# Altium schematic sheet MCU.SchDoc
size A3; SheetNumber: 3; SheetTotal: 7
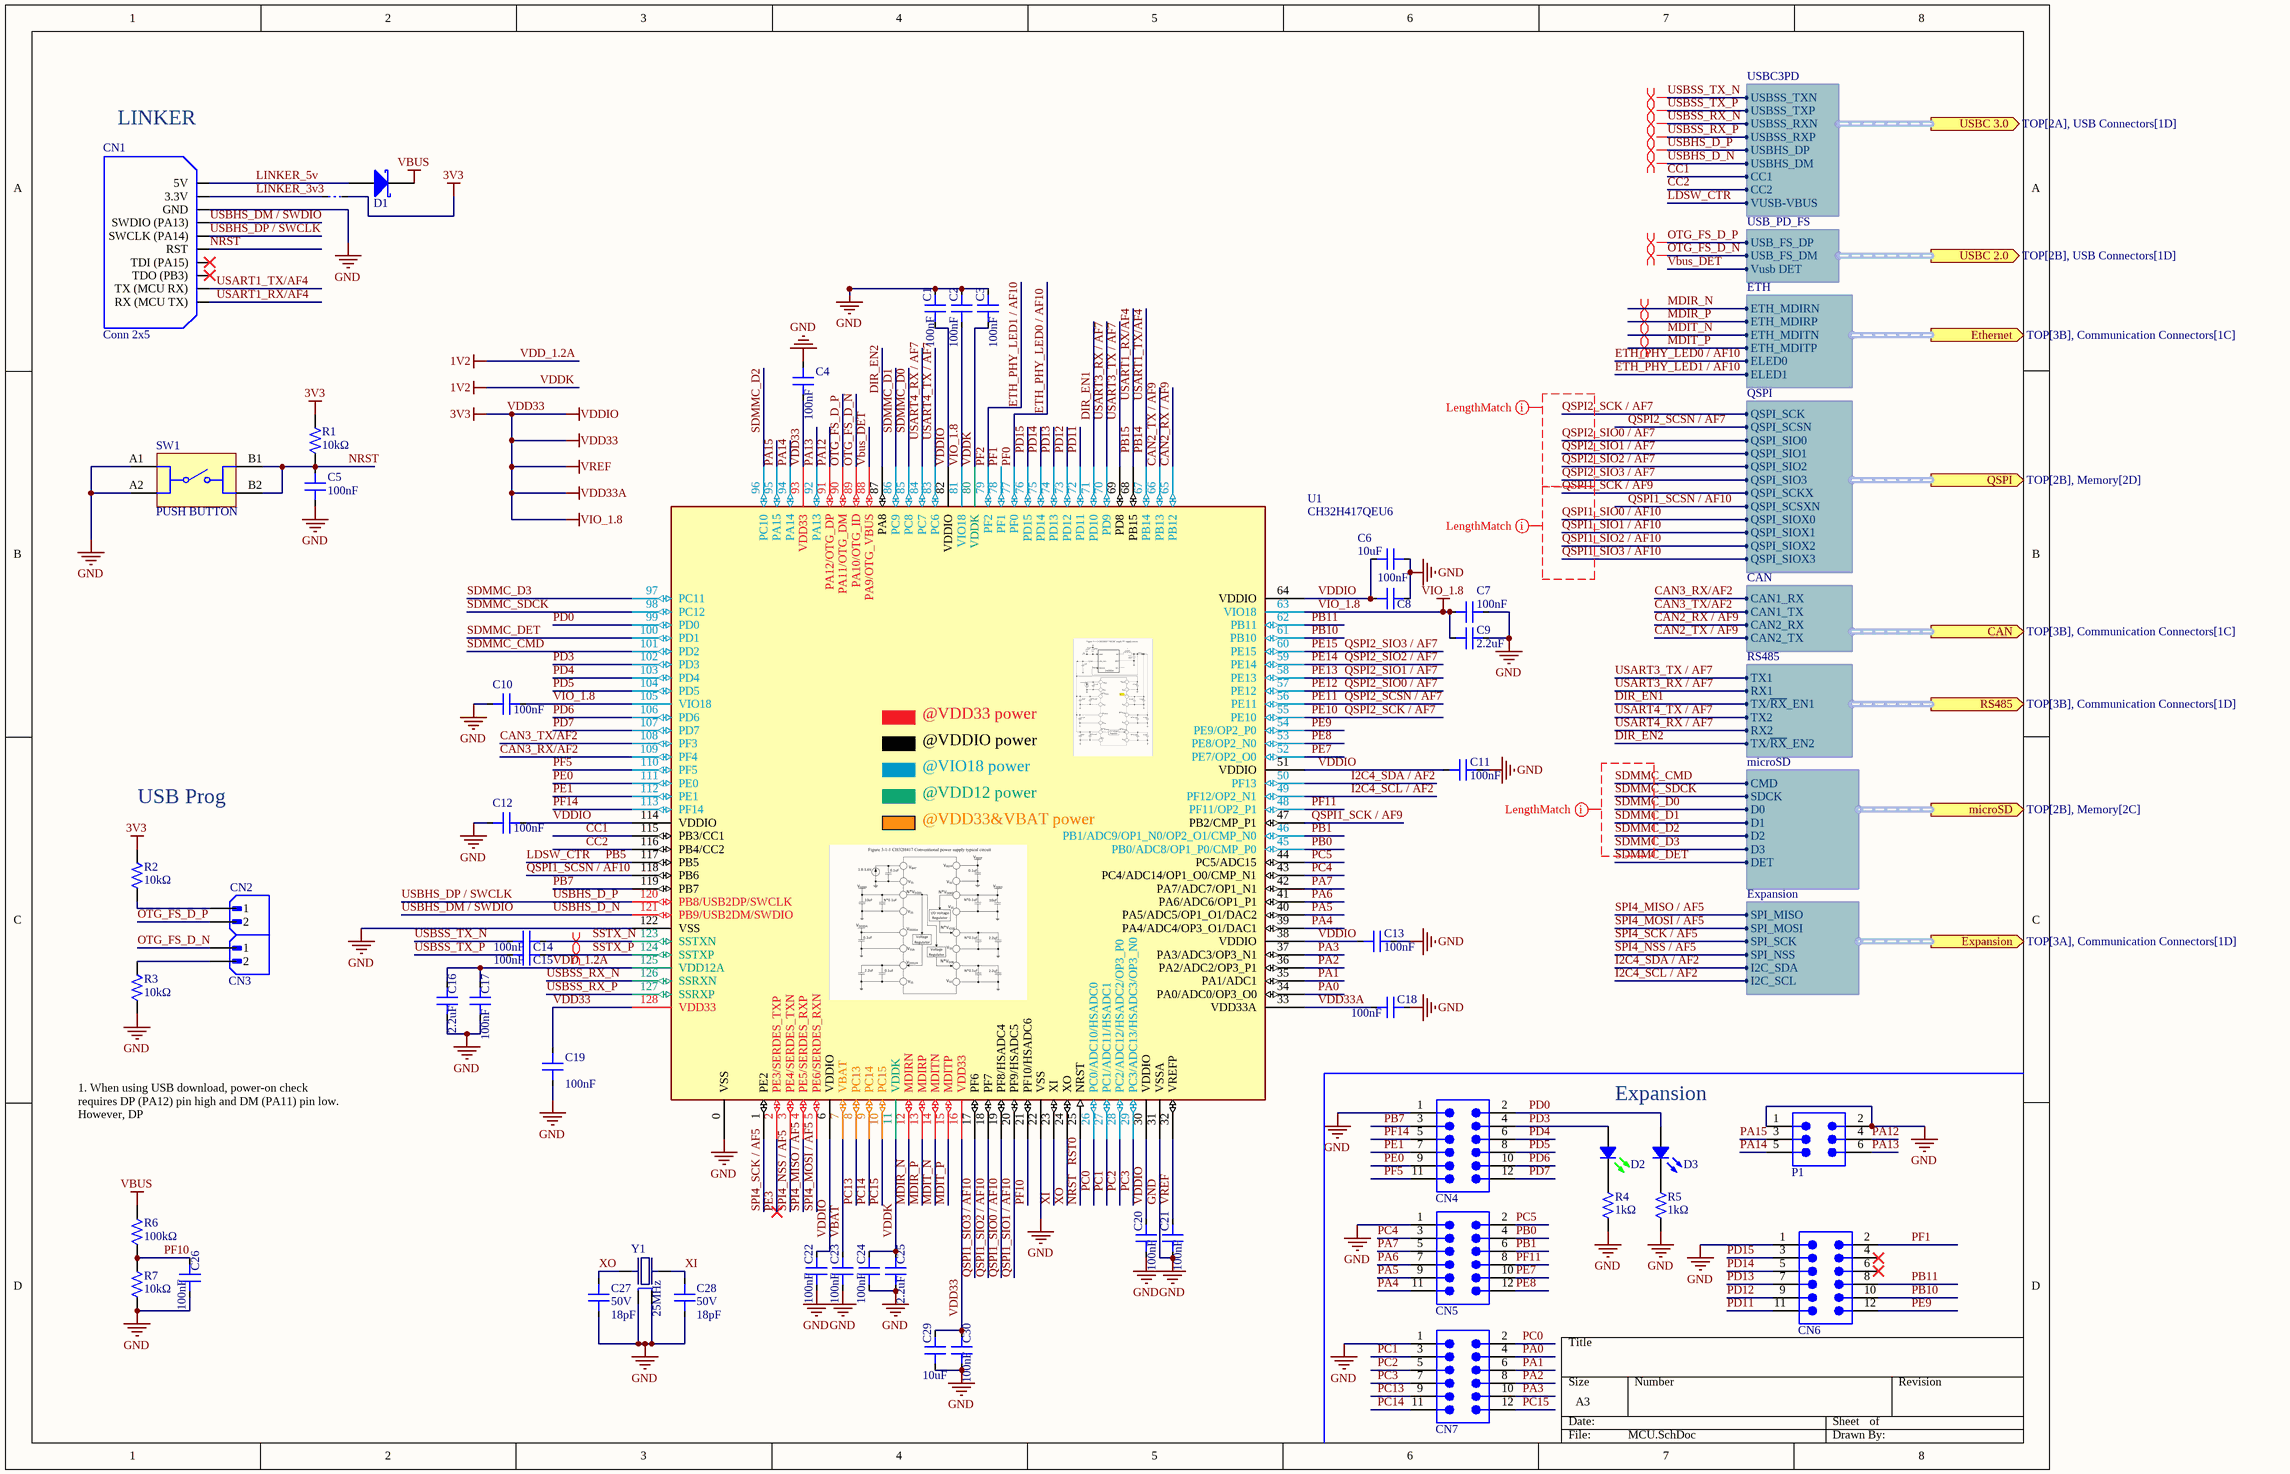
[diagram p0: MCU.SchDoc]

## Parts
C1  Capacitance: 100nF  [C_0603]  (hidden comment: CAP CER 100nF 50V X7R 0603)
C2  Capacitance: 100nF  [C_0603]  (hidden comment: CAP CER 100nF 50V X7R 0603)
C3  Capacitance: 100nF  [C_0603]  (hidden comment: CAP CER 100nF 50V X7R 0603)
C4  Capacitance: 100nF  [C_0603]  (hidden comment: CAP CER 100nF 50V X7R 0603)
C5  Capacitance: 100nF  [C_0603]  (hidden comment: CAP CER 100nF 50V X7R 0603)
C6  Capacitance: 10uF  [C_0805]  (hidden comment: CAP CER 10uF 16V X7R 0805)
C7  Capacitance: 100nF  [C_0603]  (hidden comment: CAP CER 100nF 50V X7R 0603)
C8  Capacitance: 100nF  [C_0603]  (hidden comment: CAP CER 100nF 50V X7R 0603)
C9  Capacitance: 2.2uF  [C_0603]  (hidden comment: CAP CER 2.2uF 16V X5R 0603)
C10  Capacitance: 100nF  [C_0603]  (hidden comment: CAP CER 100nF 50V X7R 0603)
C11  Capacitance: 100nF  [C_0603]  (hidden comment: CAP CER 100nF 50V X7R 0603)
C12  Capacitance: 100nF  [C_0603]  (hidden comment: CAP CER 100nF 50V X7R 0603)
C13  Capacitance: 100nF  [C_0603]  (hidden comment: CAP CER 100nF 50V X7R 0603)
C14  Capacitance: 100nF  [C_0603]  (hidden comment: CAP CER 100nF 50V X7R 0603)
C15  Capacitance: 100nF  [C_0603]  (hidden comment: CAP CER 100nF 50V X7R 0603)
C16  Capacitance: 2.2uF  [C_0603]  (hidden comment: CAP CER 2.2uF 16V X5R 0603)
C17  Capacitance: 100nF  [C_0603]  (hidden comment: CAP CER 100nF 50V X7R 0603)
C18  Capacitance: 100nF  [C_0603]  (hidden comment: CAP CER 100nF 50V X7R 0603)
C19  Capacitance: 100nF  [C_0603]  (hidden comment: CAP CER 100nF 50V X7R 0603)
C20  Capacitance: 100nF  [C_0603]  (hidden comment: CAP CER 100nF 50V X7R 0603)
C21  Capacitance: 100nF  [C_0603]  (hidden comment: CAP CER 100nF 50V X7R 0603)
C22  Capacitance: 100nF  [C_0603]  (hidden comment: CAP CER 100nF 50V X7R 0603)
C23  Capacitance: 100nF  [C_0603]  (hidden comment: CAP CER 100nF 50V X7R 0603)
C24  Capacitance: 100nF  [C_0603]  (hidden comment: CAP CER 100nF 50V X7R 0603)
C25  Capacitance: 2.2uF  [C_0603]  (hidden comment: CAP CER 2.2uF 16V X5R 0603)
C26  Capacitance: 100nF  [C_0603]  (hidden comment: CAP CER 100nF 50V X7R 0603)
C27  Voltage Rating: 50V  Capacitance: 18pF  [C_0603]  (hidden comment: CAP CER 18pF 50V C0G 0603)
C28  Voltage Rating: 50V  Capacitance: 18pF  [C_0603]  (hidden comment: CAP CER 18pF 50V C0G 0603)
C29  Capacitance: 10uF  [C_0805]  (hidden comment: CAP CER 10uF 16V X7R 0805)
C30  Capacitance: 100nF  [C_0603]  (hidden comment: CAP CER 100nF 50V X7R 0603)
CN1  Conn 2x5  [IDC_2x5P_2.54MM_TH]
CN2  CONN HEADER 2POS 2.54mm SINGLE ROW TH  [HEADER_M_2P_2.54MM_TH]  (value not drawn)
CN3  CONN HEADER 2POS 2.54mm SINGLE ROW TH  [HEADER_M_2P_2.54MM_TH]  (value not drawn)
CN4  CONN HEADER 12POS 2.54mm DUAL ROW TH  [HEADER_M_2x6P_2.54MM_TH]  (value not drawn)
CN5  CONN HEADER 12POS 2.54mm DUAL ROW TH  [HEADER_M_2x6P_2.54MM_TH]  (value not drawn)
CN6  CONN HEADER 12POS 2.54mm DUAL ROW TH  [HEADER_M_2x6P_2.54MM_TH]  (value not drawn)
CN7  CONN HEADER 12POS 2.54mm DUAL ROW TH  [HEADER_M_2x6P_2.54MM_TH]  (value not drawn)
D1  DIODE SCHOTTKY 40V SOD-323  [SOD323]  (value not drawn)
D2  LED EMERALD GREEN WATER CLEAR 0603 SMD  [LED_0603]  (value not drawn)
D3  LED BLUE WATER CLEAR 0603 SMD  [LED_0603]  (value not drawn)
J1  JUMPER SMD  [JUMPER SMD 3X1.5 mm]  (value not drawn)  (no BOM)
P1  CONN SOCKET 6POS 2.54mm DUAL ROW TH  [HEADER_F_2x3P_2.54MM_TH]  (value not drawn)
R1  Resistance: 10kΩ  [R_0603]  (hidden comment: RES 10kΩ ±1% 100mW 0603)
R2  Resistance: 10kΩ  [R_0603]  (hidden comment: RES 10kΩ ±1% 100mW 0603)
R3  Resistance: 10kΩ  [R_0603]  (hidden comment: RES 10kΩ ±1% 100mW 0603)
R4  Resistance: 1kΩ  [R_0603]  (hidden comment: RES 1kΩ ±1% 100mW 0603)
R5  Resistance: 1kΩ  [R_0603]  (hidden comment: RES 1kΩ ±1% 100mW 0603)
R6  Resistance: 100kΩ  [R_0603]  (hidden comment: RES 100kΩ ±1% 100mW 0603)
R7  Resistance: 10kΩ  [R_0603]  (hidden comment: RES 10kΩ ±1% 100mW 0603)
SW1  PUSH BUTTON  [Tact Switch 6X6X9.5MM]
U1  CH32H417QEU6  [QFN128_12.3X12.3]
Y1  Frequency: 25MHz  [XTAL_SMD3225-4P]  (hidden comment: CRYSTAL 25MHz 12pF SMD)

## Ports
CAN (out, harness CAN, see TOP[3B], Communication Connectors[1C]), Ethernet (out, harness ETH, see TOP[3B], Communication Connectors[1C]), Expansion (out, harness Expansion, see TOP[3A], Communication Connectors[1D]), microSD (out, harness microSD, see TOP[2B], Memory[2C]), QSPI (out, harness QSPI, see TOP[2B], Memory[2D]), RS485 (out, harness RS485, see TOP[3B], Communication Connectors[1D]), USBC 2.0 (out, harness USB_PD_FS, see TOP[2B], USB Connectors[1D]), USBC 3.0 (out, harness USBC3PD, see TOP[2A], USB Connectors[1D])

## Harnesses
USB_PD_FS: USB_FS_DP, USB_FS_DM, Vusb DET
USBC3PD: USBHS_DM, USBHS_DP, USBSS_RXP, USBSS_RXN, USBSS_TXP, USBSS_TXN, CC1, CC2, VUSB-VBUS
ETH: ETH_MDIRN, ETH_MDIRP, ETH_MDITN, ETH_MDITP, ELED0, ELED1
QSPI: QSPI_SCK, QSPI_SCSN, QSPI_SIO0, QSPI_SIO1, QSPI_SIO2, QSPI_SIO3, QSPI_SCSXN, QSPI_SIOX0, QSPI_SIOX1, QSPI_SIOX2, QSPI_SIOX3, QSPI_SCKX
CAN: CAN1_RX, CAN1_TX, CAN2_TX, CAN2_RX
RS485: TX1, RX1, TX/~{R}~{X}_EN1, TX2, RX2, TX/~{R}~{X}_EN2
microSD: CMD, SDCK, D0, D1, D2, D3, DET
Expansion: SPI_MISO, SPI_MOSI, SPI_SCK, SPI_NSS, I2C_SDA, I2C_SCL

## Nets
GND: C1.1 C2.1 C3.1 C4.1 C5.1 C6.2 C7.1 C8.1 C9.2 C10.1 C11.1 C12.2 C13.2 C16.2 C17.2 C18.2 C19.2 C20.1 C21.2 C22.2 C23.2 C24.2 C25.1 C26.2 C27.1 C28.1 C29.2 C30.2 CN1.5(GND) CN4.1 CN5.1 CN6.1 CN7.1 P1.1 P1.2 R3.2 R4.2 R5.2 R7.2 SW1.A1 SW1.A2 U1.0(VSS) U1.22(VSS) U1.31(VSSA) U1.122(VSS) Y1.2(GND) Y1.4(GND)
VBUS: D1.2(K) R6.2
VDD33: C1.2 C2.2 C4.2 C6.1 C7.2 C8.2 C9.1 C10.2 C11.2 C12.1 C13.1 C18.1 C19.1 C20.2 C21.1 C22.1 C29.1 C30.1 J1.1 R1.2 R2.2 U1.6(VDDIO) U1.16(VDD33) U1.30(VDDIO) U1.32(VREFP) U1.33(VDD33A) U1.38(VDDIO) U1.51(VDDIO) U1.63(VIO18) U1.64(VDDIO) U1.81(VIO18) U1.82(VDDIO) U1.93(VDD33) U1.105(VIO18) U1.114(VDDIO) U1.128(VDD33)  [also labelled 3V3, VDD33A, VDDIO, VIO_1.8, VREF]
VDD_1.2A: C3.2 C16.1 C17.1 C24.1 C25.2 U1.11(VDDK) U1.80(VDDK) U1.125(VDD12A)  [also labelled 1V2, VDDK]
CAN2_RX / AF9: U1.65(PB12) ; port CAN.CAN2_RX
CAN2_TX / AF9: U1.66(PB13) ; port CAN.CAN2_TX
CAN3_RX/AF2: U1.109(PF4) ; port CAN.CAN1_RX
CAN3_TX/AF2: U1.108(PF3) ; port CAN.CAN1_TX
CC1: U1.115(PB3/CC1) ; port USBC 3.0.CC1
CC2: U1.116(PB4/CC2) ; port USBC 3.0.CC2
DIR_EN1: U1.71(PD10) ; port RS485.TX/~{R}~{X}_EN1
DIR_EN2: U1.87(PA8) ; port RS485.TX/~{R}~{X}_EN2
ETH_PHY_LED0 / AF10: U1.77(PF0) ; port Ethernet.ELED0  [also labelled PF0]
ETH_PHY_LED1 / AF10: U1.79(PF2) ; port Ethernet.ELED1  [also labelled PF2]
I2C4_SCL / AF2: U1.49(PF12/OP2_N1) ; port Expansion.I2C_SCL
I2C4_SDA / AF2: U1.50(PF13) ; port Expansion.I2C_SDA
LDSW_CTR: U1.117(PB5) ; port USBC 3.0.VUSB-VBUS  [also labelled PB5]
LINKER_3v3: CN1.3(3.3V) J1.2(G)
LINKER_5v: CN1.1(5V) D1.1(A)
MDIR_N: U1.12(MDIRN) ; port Ethernet.ETH_MDIRN
MDIR_P: U1.13(MDIRP) ; port Ethernet.ETH_MDIRP
MDIT_N: U1.14(MDITN) ; port Ethernet.ETH_MDITN
MDIT_P: U1.15(MDITP) ; port Ethernet.ETH_MDITP
NRST: C5.2 CN1.2(RST) R1.1 SW1.B1 SW1.B2 U1.25(NRST)  [also labelled RST0]
OTG_FS_D_N: CN3.1 U1.89(PA10/OTG_ID) ; port USBC 2.0.USB_FS_DM
OTG_FS_D_P: CN2.2 U1.90(PA11/OTG_DM) ; port USBC 2.0.USB_FS_DP
PA0: CN7.4 U1.34(PA0/ADC0/OP3_O0)
PA1: CN7.6 U1.35(PA1/ADC1)
PA2: CN7.8 U1.36(PA2/ADC2/OP3_P1)
PA3: CN7.10 U1.37(PA3/ADC3/OP3_N1)
PA4: CN5.11 U1.39(PA4/ADC4/OP3_O1/DAC1)
PA5: CN5.9 U1.40(PA5/ADC5/OP1_O1/DAC2)
PA6: CN5.7 U1.41(PA6/ADC6/OP1_P1)
PA7: CN5.5 U1.42(PA7/ADC7/OP1_N1)
PA12: P1.4 U1.91(PA12/OTG_DP)
PA13: P1.6 U1.92(PA13)
PA14: P1.5 U1.94(PA14)
PA15: P1.3 U1.95(PA15)
PB0: CN5.4 U1.45(PB0/ADC8/OP1_P0/CMP_P0)
PB1: CN5.6 U1.46(PB1/ADC9/OP1_N0/OP2_O1/CMP_N0)
PB7: CN4.3 U1.119(PB7)
PB10: CN6.10 U1.61(PB10)
PB11: CN6.8 U1.62(PB11)
PB14: CN1.8(TX_(MCU_RX)) U1.67(PB14)  [also labelled USART1_TX/AF4]
PB15: CN1.10(RX_(MCU_TX)) U1.68(PB15)  [also labelled USART1_RX/AF4]
PC0: CN7.2 U1.26(PC0/ADC10/HSADC0)
PC1: CN7.3 U1.27(PC1/ADC11/HSADC1)
PC2: CN7.5 U1.28(PC2/ADC12/HSADC2/OP3_P0)
PC3: CN7.7 U1.29(PC3/ADC13/HSADC3/OP3_N0)
PC4: CN5.3 U1.43(PC4/ADC14/OP1_O0/CMP_N1)
PC5: CN5.2 U1.44(PC5/ADC15)
PC13: CN7.9 U1.8(PC13)
PC14: CN7.11 U1.9(PC14)
PC15: CN7.12 U1.10(PC15)
PD0: CN4.2 D3.1 U1.99(PD0)
PD3: CN4.4 D2.1 U1.102(PD3)
PD4: CN4.6 U1.103(PD4)
PD5: CN4.8 U1.104(PD5)
PD6: CN4.10 U1.106(PD6)
PD7: CN4.12 U1.107(PD7)
PD11: CN6.11 U1.72(PD11)
PD12: CN6.9 U1.73(PD12)
PD13: CN6.7 U1.74(PD13)
PD14: CN6.5 U1.75(PD14)
PD15: CN6.3 U1.76(PD15)
PE0: CN4.9 U1.111(PE0)
PE1: CN4.7 U1.112(PE1)
PE3: U1.2(PE3/SERDES_TXP)
PE7: CN5.10 U1.52(PE7/OP2_O0)
PE8: CN5.12 U1.53(PE8/OP2_N0)
PE9: CN6.12 U1.54(PE9/OP2_P0)
PE10: U1.55(PE10) ; port QSPI.QSPI_SCK  [also labelled QSPI2_SCK / AF7]
PE11: U1.56(PE11) ; port QSPI.QSPI_SCSN  [also labelled QSPI2_SCSN / AF7]
PE12: U1.57(PE12) ; port QSPI.QSPI_SIO0  [also labelled QSPI2_SIO0 / AF7]
PE13: U1.58(PE13) ; port QSPI.QSPI_SIO1  [also labelled QSPI2_SIO1 / AF7]
PE14: U1.59(PE14) ; port QSPI.QSPI_SIO2  [also labelled QSPI2_SIO2 / AF7]
PE15: U1.60(PE15) ; port QSPI.QSPI_SIO3  [also labelled QSPI2_SIO3 / AF7]
PF1: CN6.2 U1.78(PF1)
PF5: CN4.11 U1.110(PF5)
PF10: C26.1 R6.1 R7.1 U1.21(PF10/HSADC6)
PF11: CN5.8 U1.48(PF11/OP2_P1)
PF14: CN4.5 U1.113(PF14)
QSPI1_SCK / AF9: U1.47(PB2/CMP_P1) ; port QSPI.QSPI_SCKX
QSPI1_SCSN / AF10: U1.118(PB6) ; port QSPI.QSPI_SCSXN
QSPI1_SIO0 / AF10: U1.19(PF8/HSADC4) ; port QSPI.QSPI_SIOX0
QSPI1_SIO1 / AF10: U1.20(PF9/HSADC5) ; port QSPI.QSPI_SIOX1
QSPI1_SIO2 / AF10: U1.18(PF7) ; port QSPI.QSPI_SIOX2
QSPI1_SIO3 / AF10: U1.17(PF6) ; port QSPI.QSPI_SIOX3
SDMMC_CMD: U1.101(PD2) ; port microSD.CMD
SDMMC_D0: U1.85(PC8) ; port microSD.D0
SDMMC_D1: U1.86(PC9) ; port microSD.D1
SDMMC_D2: U1.96(PC10) ; port microSD.D2
SDMMC_D3: U1.97(PC11) ; port microSD.D3
SDMMC_DET: U1.100(PD1) ; port microSD.DET
SDMMC_SDCK: U1.98(PC12) ; port microSD.SDCK
SPI4_MISO / AF5: U1.4(PE5/SERDES_RXP) ; port Expansion.SPI_MISO
SPI4_MOSI / AF5: U1.5(PE6/SERDES_RXN) ; port Expansion.SPI_MOSI
SPI4_NSS / AF5: U1.3(PE4/SERDES_TXN) ; port Expansion.SPI_NSS
SPI4_SCK / AF5: U1.1(PE2) ; port Expansion.SPI_SCK
SSTX_N: C14.1 U1.123(SSTXN)
SSTX_P: C15.1 U1.124(SSTXP)
USART3_RX / AF7: U1.70(PD9) ; port RS485.RX1
USART3_TX / AF7: U1.69(PD8) ; port RS485.TX1
USART4_RX / AF7: U1.84(PC7) ; port RS485.RX2
USART4_TX / AF7: U1.83(PC6) ; port RS485.TX2
USBHS_D_N: CN1.7(SWDIO_(PA13)) U1.121(PB9/USB2DM/SWDIO) ; port USBC 3.0.USBHS_DM  [also labelled USBHS_DM / SWDIO]
USBHS_D_P: CN1.9(SWCLK_(PA14)) U1.120(PB8/USB2DP/SWCLK) ; port USBC 3.0.USBHS_DP  [also labelled USBHS_DP / SWCLK]
USBSS_RX_N: U1.126(SSRXN) ; port USBC 3.0.USBSS_RXN
USBSS_RX_P: U1.127(SSRXP) ; port USBC 3.0.USBSS_RXP
USBSS_TX_N: C14.2 ; port USBC 3.0.USBSS_TXN
USBSS_TX_P: C15.2 ; port USBC 3.0.USBSS_TXP
VBAT: C23.1 U1.7(VBAT)
Vbus_DET: U1.88(PA9/OTG_VBUS) ; port USBC 2.0.Vusb DET
XI: C28.2 U1.23(XI) Y1.1(XTAL1)
XO: C27.2 U1.24(XO) Y1.3(XTAL2)
NetCN2_1: CN2.1 R2.1
NetCN3_2: CN3.2 R3.1
NetD2_2: D2.2 R4.1
NetD3_2: D3.2 R5.1

Not connected (* = marked no-connect by the designer): CN1 4(TDI_(PA15))* 6(TDO_(PB3))*; CN6 4* 6*

## Layout directives
differential pair; differential pair class 90ohm: OTG_FS_D_N, OTG_FS_D_P, SSTX_N, SSTX_P, USBHS_D_N, USBHS_D_P, USBSS_RX_N, USBSS_RX_P, USBSS_TX_N, USBSS_TX_P
net class QSPI1: QSPI1_SCK / AF9, QSPI1_SIO0 / AF10, QSPI1_SIO1 / AF10, QSPI1_SIO2 / AF10, QSPI1_SIO3 / AF10
net class QSPI2: QSPI2_SCK / AF7, QSPI2_SIO0 / AF7, QSPI2_SIO1 / AF7, QSPI2_SIO2 / AF7, QSPI2_SIO3 / AF7
net class SDMMC: SDMMC_CMD, SDMMC_D0, SDMMC_D1, SDMMC_D2, SDMMC_D3, SDMMC_SDCK
differential pair; differential pair class 100ohm: MDIR_N, MDIR_P, MDIT_N, MDIT_P

## Notes on the sheet
- LINKER
- USB Prog
- Expansion
- 1. When using USB download, power-on check requires DP (PA12) pin high and DM (PA11) pin low. However, DP
  pin must not remain pulled up, otherwise USB functionality will be abnormal.
- (in symbol CH32H417QET6) @VDD33 power; @VDDIO power; @VIO18 power; @VDD12 power; @VDD33&VBAT power

## Library data of the parts
C1-C5 C7 C8 C10-C13 C17-C24 C26 C30 = CC0603KRX7R9BB104: 100nF ±10% 50V Ceramic Capacitor X7R 0603; Manufacturer: YAGEO; Symbol Path 1: Symbols\Standard.SchLib; Unit Price (USD): 0.0175; Voltage Rating: 50V; MPN: CC0603KRX7R9BB104; LCSC Part #: C14663; Package: 0603; JLC Part Type: Basic; LCSC Stock: 10701000; JLC Stock: 72739428; MOQ: 50; Datasheet: https://datasheet.lcsc.com/datasheet/pdf/23ccee80ee542e7cf156a772bb589942.pdf?productCode=C14663; URL: https://www.lcsc.com/product-detail/C14663.html; Status: ok; Tolerance: ±10%; TempCo: X7R
C6 C29 = CL21B106KOQNNNE: 10uF ±10% 16V Ceramic Capacitor X7R 0805; Manufacturer: Samsung Electro-Mechanics; Symbol Path 1: Symbols\Standard.SchLib; Unit Price (USD): 0.1057; Voltage Rating: 16V; MPN: CL21B106KOQNNNE; LCSC Part #: C95841; Package: 0805; JLC Part Type: Extended; LCSC Stock: 472010; JLC Stock: 550231; MOQ: 10; Datasheet: https://datasheet.lcsc.com/datasheet/pdf/02336ea48ea44ca18c72517dd3cb7b47.pdf?productCode=C95841; URL: https://www.lcsc.com/product-detail/C95841.html; Status: ok; Tolerance: ±10%; TempCo: X7R
C9 C16 C25 = CL10A225KO8NNNC: 2.2uF ±10% 16V Ceramic Capacitor X5R 0603; Manufacturer: Samsung Electro-Mechanics; Symbol Path 1: Symbols\Standard.SchLib; Unit Price (USD): 0.0195; Voltage Rating: 16V; MPN: CL10A225KO8NNNC; LCSC Part #: C23630; Package: 0603; JLC Part Type: Basic; LCSC Stock: 2699650; JLC Stock: 4726599; MOQ: 50; Datasheet: https://datasheet.lcsc.com/datasheet/pdf/02336ea48ea44ca18c72517dd3cb7b47.pdf?productCode=C23630; URL: https://www.lcsc.com/product-detail/C23630.html; Status: ok; Tolerance: ±10%; TempCo: X5R
C14 C15 = C14663: 100nF ±10% 50V Ceramic Capacitor X7R 0603; Manufacturer: YAGEO; MPN: CC0603KRX7R9BB104; Symbol Path 1: Symbols\Standard.SchLib; Unit Price (USD): 0.0175; Voltage Rating: 50V; LCSC Part #: C14663; Package: 0603; JLC Part Type: Basic; LCSC Stock: 10701000; JLC Stock: 72739428; MOQ: 50; Datasheet: https://datasheet.lcsc.com/datasheet/pdf/23ccee80ee542e7cf156a772bb589942.pdf?productCode=C14663; URL: https://www.lcsc.com/product-detail/C14663.html; Status: ok; Tolerance: ±10%; TempCo: X7R
C27 C28 = C1647: 18pF ±5% 50V Ceramic Capacitor C0G 0603; Manufacturer: Samsung Electro-Mechanics; MPN: CL10C180JB8NNNC; Symbol Path 1: Symbols\Standard.SchLib; Unit Price (USD): 0.0118; LCSC Part #: C1647; Package: 0603; JLC Part Type: Basic; LCSC Stock: 129350; JLC Stock: 451288; MOQ: 50; Datasheet: https://datasheet.lcsc.com/datasheet/pdf/02336ea48ea44ca18c72517dd3cb7b47.pdf?productCode=C1647; URL: https://www.lcsc.com/product-detail/C1647.html; Status: ok; Tolerance: ±5%; TempCo: C0G
CN1 = WCH LINKE Debugger connector: CONN For WCH LINKE Debugger; Supplier 1: LCSC; Supplier Part Number 1: C7501191; ComponentLink1Description: Datasheet; ComponentLink1URL: https://www.wch-ic.com/downloads/WCH-LinkUserManual_PDF.html; ComponentLink2Description: New link; ComponentLink2URL: https://www.ram-e-shop.com/shop/fc10-pcb-idc10-male-polarized-fc10-pcb-5991
CN2 CN3 = PZ254V-11-02P: Manufacturer: XFCN; Symbol Path 1: Symbols\Standard_CONN.SchLib; Unit Price (USD): 0.0188; Positions: 2P; Rows: 1; Mating Length: 6.1mm; Gender: Male; MPN: PZ254V-11-02P; LCSC Part #: C492401; Package: Through Hole,P=2.54mm; JLC Part Type: Extended; LCSC Stock: 1292950; JLC Stock: 1306930; MOQ: 50; Datasheet: https://datasheet.lcsc.com/datasheet/pdf/3b85a1cdf6ed945f2e278f00c1e42442.pdf?productCode=C492401; URL: https://www.lcsc.com/product-detail/C492401.html; Status: ok; Pitch: 2.54mm; Insulation Height: 2.5mm
CN4-CN7 = ZX-PZ2.54-2-6PZZ: Pin Header 12 Position 2.54mm Pitch Dual Row Through Hole -40℃~+105℃; Manufacturer: Megastar; Symbol Path 1: Symbols\Standard_CONN.SchLib; Unit Price (USD): 0.081; Positions: 12P; Rows: 2; Mating Length: 6mm; Gender: Male; MPN: ZX-PZ2.54-2-6PZZ; LCSC Part #: C7501277; Package: Through Hole,P=2.54mm; JLC Part Type: Extended; LCSC Stock: 33900; JLC Stock: 33900; MOQ: 5; Datasheet: https://datasheet.lcsc.com/datasheet/pdf/cb02df43e6c1436321002b51626eb82d.pdf?productCode=C7501277; URL: https://www.lcsc.com/product-detail/C7501277.html; Status: ok; Pitch: 2.54mm; Insulation Height: 2.5mm
D1 = 1N5819WS: Diode 40V 1A Surface Mount SOD-323; Manufacturer: Guangdong Hottech; Symbol Path 1: Symbols\Standard.SchLib; Unit Price (USD): 0.0139; Forward Voltage: 600mV@1A; MPN: 1N5819WS; LCSC Part #: C191023; Package: SOD-323; JLC Part Type: Basic; LCSC Stock: 4984450; JLC Stock: 5626571; MOQ: 50; Datasheet: https://datasheet.lcsc.com/datasheet/pdf/c7a6590686b7be2f86b8eed4480e569c.pdf?productCode=C191023; URL: https://www.lcsc.com/product-detail/C191023.html; Status: ok; Voltage Rating: 40V; Current Rating: 1A; Subcategory: Schottky
D2 = XL-1608UGC-04: Emerald Green 525nm LED Indication - Discrete 3.3V 0603; Manufacturer: XINGLIGHT; Symbol Path 1: Symbols\Standard.SchLib; Unit Price (USD): 0.0051; Forward Current: 20mA; Luminous: 810mcd; Supplier 1: MAKERS; Supplier Part Number 1: https://makerselectronics.com/product/smd-led-blue-1206; ComponentLink1Description: MAKERS; ComponentLink1URL: https://makerselectronics.com/product/smd-led-blue-1206; MPN: XL-1608UGC-04; LCSC Part #: C965804; Package: 0603; JLC Part Type: Extended; LCSC Stock: 3767100; JLC Stock: 3839769; MOQ: 100; Datasheet: https://datasheet.lcsc.com/datasheet/pdf/6b7293b42c3b9e043993e4b0f98f47bf.pdf?productCode=C965804; URL: https://www.lcsc.com/product-detail/C965804.html; Status: ok; Colour: Emerald Green; Forward Voltage: 3.3V
D3 = XL-1608UBC-04: Blue 470nm LED Indication - Discrete 3.3V 0603; Manufacturer: XINGLIGHT; Symbol Path 1: Symbols\Standard.SchLib; Unit Price (USD): 0.0043; Forward Current: 20mA; Luminous: 300mcd; Supplier 1: MAKERS; Supplier Part Number 1: https://makerselectronics.com/product/smd-led-blue-1206; ComponentLink1Description: MAKERS; ComponentLink1URL: https://makerselectronics.com/product/smd-led-blue-1206; MPN: XL-1608UBC-04; LCSC Part #: C965807; Package: 0603; JLC Part Type: Extended; LCSC Stock: 2339700; JLC Stock: 2377083; MOQ: 100; Datasheet: https://datasheet.lcsc.com/datasheet/pdf/399b5621ad7d893d62c6cc75a71fb1c5.pdf?productCode=C965807; URL: https://www.lcsc.com/product-detail/C965807.html; Status: ok; Colour: Blue; Forward Voltage: 3.3V
P1 = PM254V-12-06-H85: Female Header 6 Position 2.54mm Pitch Dual Row Through Hole; Manufacturer: XFCN; Symbol Path 1: Symbols\Standard_CONN.SchLib; Unit Price (USD): 0.0869; Positions: 6P; Rows: 2; MPN: PM254V-12-06-H85; LCSC Part #: C541853; Package: THROUGH HOLE,P=2.54MM; JLC Part Type: Extended; LCSC Stock: 41920; JLC Stock: 43844; MOQ: 5; Datasheet: https://datasheet.lcsc.com/datasheet/pdf/c2f8cbae228e3b2f37560392ef75a391.pdf?productCode=C541853; URL: https://www.lcsc.com/product-detail/C541853.html; Status: ok; Pitch: 2.54mm; Insulation Height: 8.5mm; Gender: Female
R1-R3 R7 = 0603WAF1002T5E: 10kΩ ±1% 100mW 0603 Thick Film Resistor; Manufacturer: UNI-ROYAL; Symbol Path 1: Symbols\Standard.SchLib; Unit Price (USD): 0.0067; Voltage Rating: 75V; TempCo: ±100ppm/℃; MPN: 0603WAF1002T5E; Package: 0603; Datasheet: https://datasheet.lcsc.com/datasheet/pdf/0a975aaa49b7c97f38a963127be4a823.pdf?productCode=C25804; Power: 100mW; LCSC Part #: C25804; JLC Part Type: Basic; LCSC Stock: 0; JLC Stock: 6329063; MOQ: 100; URL: https://www.lcsc.com/product-detail/C25804.html; Status: ok; Tolerance: ±1%; Composition: Thick Film Resistor
R4 R5 = 0603WAF1001T5E: 1kΩ ±1% 100mW 0603 Thick Film Resistor; Manufacturer: UNI-ROYAL; Symbol Path 1: Symbols\Standard.SchLib; Unit Price (USD): 0.0058; Voltage Rating: 75V; TempCo: ±100ppm/℃; MPN: 0603WAF1001T5E; Package: 0603; Datasheet: https://datasheet.lcsc.com/datasheet/pdf/0a975aaa49b7c97f38a963127be4a823.pdf?productCode=C21190; Power: 100mW; LCSC Part #: C21190; JLC Part Type: Basic; LCSC Stock: 7626000; JLC Stock: 31254885; MOQ: 100; URL: https://www.lcsc.com/product-detail/C21190.html; Status: ok; Tolerance: ±1%; Composition: Thick Film Resistor
R6 = C25803: 100kΩ ±1% 100mW 0603 Thick Film Resistor; MPN: 0603WAF1003T5E; Manufacturer: UNI-ROYAL; Symbol Path 1: Symbols\Standard.SchLib; Unit Price (USD): 0.0042; Voltage Rating: 75V; TempCo: ±100ppm/℃; LCSC Part #: C25803; Package: 0603; Datasheet: https://datasheet.lcsc.com/datasheet/pdf/0a975aaa49b7c97f38a963127be4a823.pdf?productCode=C25803; Power: 100mW; JLC Part Type: Basic; LCSC Stock: 13059500; JLC Stock: 21549170; MOQ: 100; URL: https://www.lcsc.com/product-detail/C25803.html; Status: ok; Tolerance: ±1%; Composition: Thick Film Resistor
SW1 = SH-6X6X8H-CJ: SWITCH PUSH BUTTON 2X2 6X6X9.5MM; Supplier 1: LCSC; Supplier Part Number 1: C42416249; ComponentLink1Description: MAKERS; ComponentLink1URL: https://makerselectronics.com/product/mini-push-button-4-pin-6x6x9-5mm
U1 = CH32H417QET6: RISC-V FPU HD-MCU, 384MHz, USB3.0 & PD, 100M Ethernet, DVP, SDMMC, QSPI, OPA, ADC, DAC
Y1 = X322525MOB4SI: Crystal 25MHz ±10ppm 12pF SMD3225-4P; Manufacturer: YXC Crystal Oscillators; Symbol Path 1: Symbols\Standard.SchLib; Unit Price (USD): 0.0954; Stability: ±20ppm; ESR: 50Ω; MPN: X322525MOB4SI; LCSC Part #: C9006; Package: SMD3225-4P; JLC Part Type: Basic; LCSC Stock: 75190; JLC Stock: 176422; MOQ: 5; Datasheet: https://datasheet.lcsc.com/datasheet/pdf/a84bd8d530dd46e4b0f6d0ee59d8a89c.pdf?productCode=C9006; URL: https://www.lcsc.com/product-detail/C9006.html; Status: ok; Load Capacitance: 12pF; Tolerance: ±10ppm